# EAGLE design tetris_bigger (EAGLE 6.2)
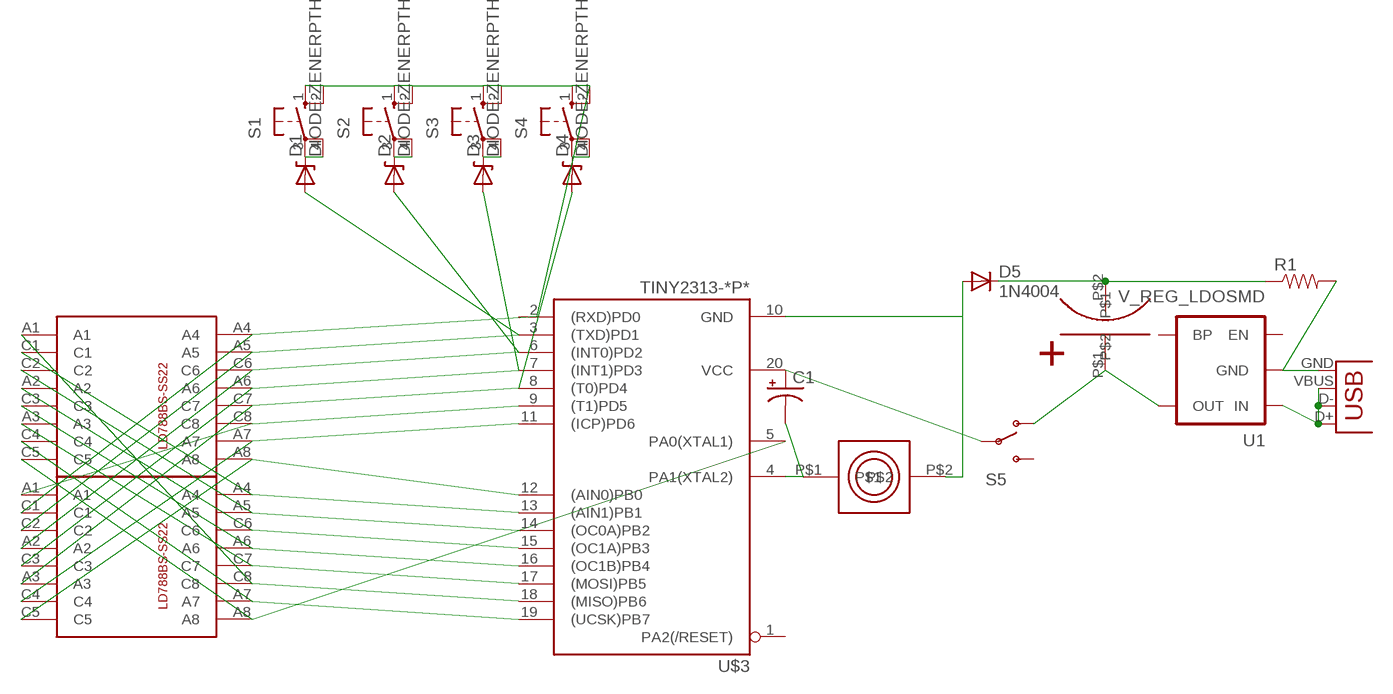
[diagram p0: schematic, sheet 1]

## Parts
C1  CAP_POLPTH1  [CPOL-RADIAL-100UF-25V]
D1  DIODE-ZENERPTH  [DIODE-ZENER]
D2  DIODE-ZENERPTH  [DIODE-ZENER]
D3  DIODE-ZENERPTH  [DIODE-ZENER]
D4  DIODE-ZENERPTH  [DIODE-ZENER]
D5  1N4004  [DO41-10]
R1  RESISTORPTH1  [AXIAL-0.3]
S1  10-XX  [B3F-10XX]
S2  10-XX  [B3F-10XX]
S3  10-XX  [B3F-10XX]
S4  10-XX  [B3F-10XX]
S5  SWITCH-SPSTSMD2  [SWITCH-SPDT-SMD]
U1  V_REG_LDOSMD  [SOT23-5]
U$1  LD-1088BS  [LD-1088BS]
U$2  LD-1088BS  [LD-1088BS]
U$3  TINY2313-*P*  [DIL20]
U$4  I-80450RF  [ISK4.1K_I-80450RF_I2G]
U$5  NICHICON_12F  [NICHICON_10X30]
X1  USB-MICROB  [USB-MICROB]

## Nets
N$1: U$1.A4 U$2.C1 U$3.13((AIN1)PB1)
N$2: U$1.A5 U$2.C2 U$3.14((OC0A)PB2)
N$3: U$1.C6 U$2.A2 U$3.15((OC1A)PB3)
N$4: U$1.A6 U$2.C3 U$3.16((OC1B)PB4)
N$5: U$1.C7 U$2.A3 U$3.17((MOSI)PB5)
N$6: U$1.A7 U$2.C4 U$3.19((UCSK)PB7)
N$7: U$1.A8 U$2.C5 U$3.5(PA0(XTAL1))
N$8: U$1.C8 U$2.A1 U$3.18((MISO)PB6)
N$9: D5.C R1.P$1 U$5.P$2
N$10: D1.P$2(A) U$1.C2 U$2.A5 U$3.3((TXD)PD1)
N$11: D2.P$2(A) U$1.A2 U$2.C6 U$3.6((INT0)PD2)
N$12: D3.P$2(A) U$1.C3 U$2.A6 U$3.7((INT1)PD3)
N$13: D4.P$2(A) U$1.A3 U$2.C7 U$3.8((T0)PD4)
N$14: U$1.A1 U$2.C8 U$3.9((T1)PD5)
N$15: U$1.C4 U$2.A7 U$3.11((ICP)PD6)
N$16: U$1.C5 U$2.A8 U$3.12((AIN0)PB0)
N$17: C1.2(-) U$3.4(PA1(XTAL2)) U$4.P$1
N$18: D5.A U$3.10(GND) U$4.P$2
N$19: S5.1(O) U1.5(OUT) U$5.P$1
N$20: D1.P$1(C) S1.3(P) S1.4(P1)
N$21: D2.P$1(C) S2.3(P) S2.4(P1)
N$22: D3.P$1(C) S3.3(P) S3.4(P1)
N$23: D4.P$1(C) S4.3(P) S4.4(P1)
N$24: R1.P$2 U1.2(GND) X1.GND
N$25: U1.1(IN) X1.D+ X1.D- X1.VBUS
N$26: C1.1(+) S5.2(P) U$3.20(VCC)
N$27: S1.1(S) S1.2(S1) S2.1(S) S2.2(S1) S3.1(S) S3.2(S1) S4.1(S) S4.2(S1) U$1.C1 U$2.A4
Unconnected: S5.3(S) U1.3(EN) U1.4(BP) U$3.1(PA2(/RESET)) U$3.2((RXD)PD0)

## Library data of the parts
C1 = SparkFun:CAP_POL: Capacitor Polarized These are standard SMD and PTH capacitors. Normally 10uF, 47uF, and 100uF in electrolytic and tantalum varieties. Always verify the external diameter of the through hole cap, it varies with capacity, voltage, and manufacturer. The EIA devices should be standard.
D1-D4 = SparkFun:DIODE-ZENER: Zener Diode Production Part - 8199 3.4V Zener Voltage
D5 = adafruit:1N4004: DIODE General purpose 1N400x type rectifier (With bigger pads) http://www.ladyada.net/library/pcb/eaglelibrary.html
R1 = SparkFun:RESISTOR: Resistor Basic schematic elements and footprints for 0603, 1206, and PTH 1/10th watt (small) resistors.
S1-S4 = switch-omron:10-XX: OMRON SWITCH; MPN: B3F-1000; OC_FARNELL: 176432; OC_NEWARK: 36M3542
S5 = SparkFun:SWITCH-SPST: SPST Switch Simple slide switch. Spark Fun Electronics SKU : COM-00102
U1 = SparkFun:V_REG_LDO: Voltage Regulator LDO Standard 150mA LDO voltage regulator in SOT-23 layout. Micrel part MIC5205. BP (by-pass) pin is used to lower output noise with 470pF cap.
U$1 U$2 = mrule:LD-1088BS
U$3 = avr-6:TINY2313*: Atmel Tiny2313 2K Flash, 128 bytes EEPROM, 128 bytes RAM
U$4 = mrule:I-80450RF
U$5 = mrule:NICHICON_12F
X1 = SparkFun:USB: USB Connectors USB-B-PTH is fully proven SKU : PRT-00139 USB-miniB is fully proven SKU : PRT-00587 USB-A-PCB is untested. USB-A-H is throughly reviewed, but untested. Spark Fun Electronics SKU : PRT-00437 USB-B-SMT is throughly reviewed, but untested. Needs silkscreen touching up. USB-A-S has not been used/tested USB-MB-H has not been used/tested

## Board
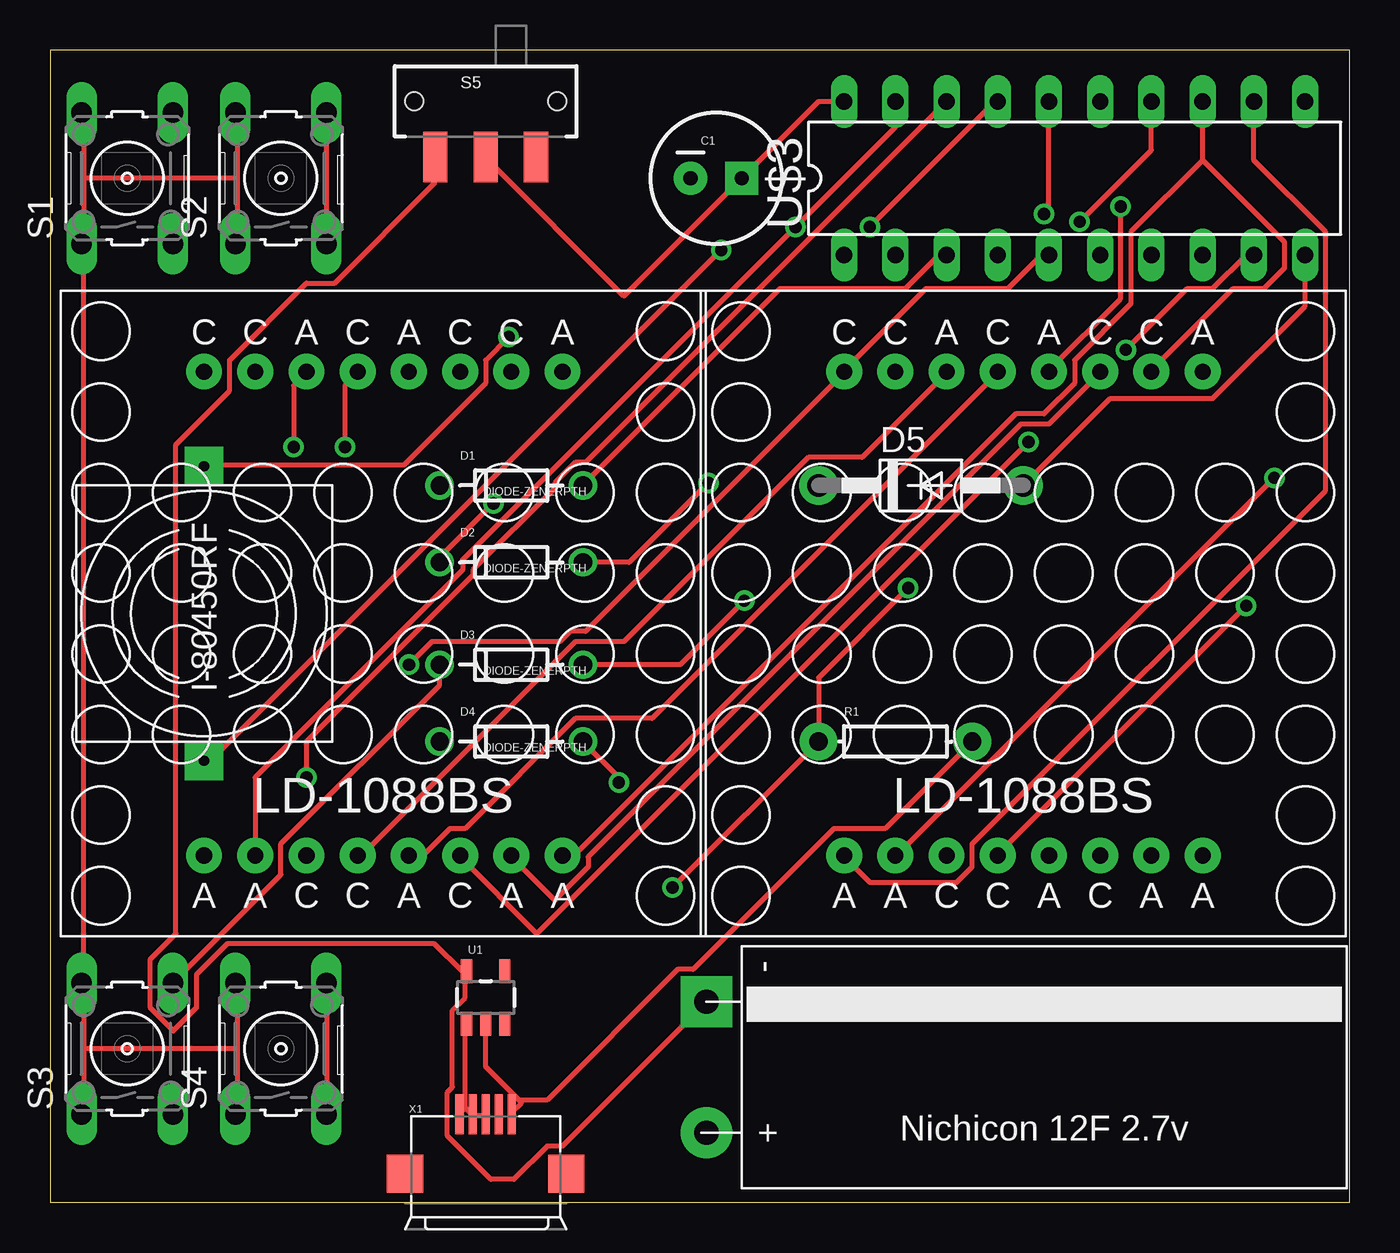
[diagram p1: board, top side]
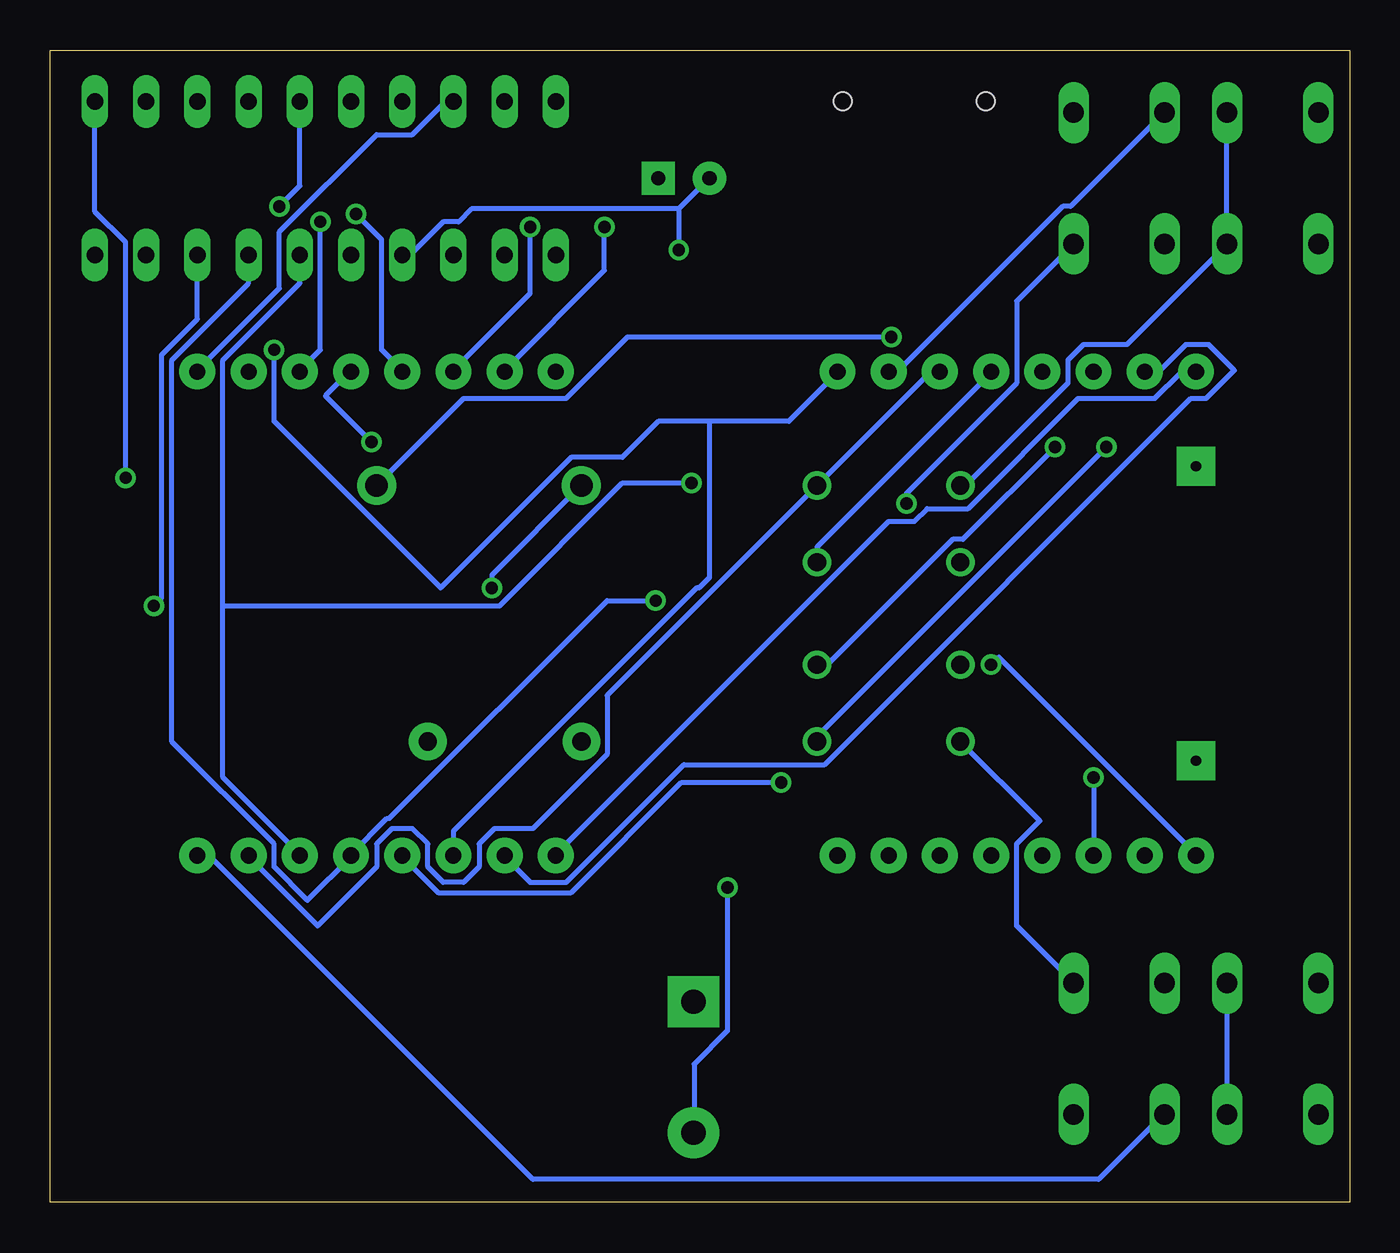
[diagram p2: board, bottom side, seen from below]

Size 64.44 x 57.14 mm. Coordinates in mm from the lower left corner, seen from the top.
Outline: 0,0 64.44,0 64.44,57.14 0,57.14 0,0
Copper layers (1*16): Top 0.035mm / dielectric 1.5mm / Bottom 0.035mm
Design rules: minimum track width 10mil, minimum drill 24mil, track to track 8mil, track to pad 8mil, pad to pad 8mil, via to via 8mil, smd to smd 8mil, copper to edge 40mil, drill to drill 8mil, minimum pad ring 10mil, minimum via ring 8mil, stop-mask expansion 4mil, vias tented up to drill 0mil, thermal gap 10mil

### Footprints (pad centres in the part's own frame; a part is rotated, then mirrored left to right if it is on the bottom)
CPOL-RADIAL-100UF-25V = drill 0.7 pad 1.651 square: 1 1.27,0 | drill 0.7 pad 1.651: 2 -1.27,0
DIODE-ZENER = drill 0.9: P$1 -3.556,0; P$2 3.556,0
DO41-10 = drill 1.118 pad 1.93: A 5.08,0; C -5.08,0
AXIAL-0.3 = drill 0.9 pad 1.88: P$1 -3.81,0; P$2 3.81,0
B3F-10XX = drill 1.016 long: 1 -3.251,2.261; 2 3.251,2.261; 3 -3.251,-2.261; 4 3.251,-2.261
SWITCH-SPDT-SMD = smd 1.2 x 2.5: 1 -2.5,-2.75; 2 0,-2.75; 3 2.5,-2.75 | hole 0.9: -3.55,0; 3.55,0
SOT23-5 = smd 0.55 x 1.2: 1 -0.95,-1.3; 2 0,-1.3; 3 0.95,-1.3; 4 0.95,1.3; 5 -0.95,1.3
LD-1088BS = drill 0.8 pad 1.778: A1 8.89,12; A2 1.27,12; A3 -3.81,12; A4 8.89,-12; A5 6.35,-12; A6 1.27,-12; A7 -6.35,-12; A8 -8.89,-12; C1 6.35,12; C2 3.81,12; C3 -1.27,12; C4 -6.35,12; C5 -8.89,12; C6 3.81,-12; C7 -1.27,-12; C8 -3.81,-12
DIL20 = drill 0.813 long: 1 -11.43,-3.81; 2 -8.89,-3.81; 3 -6.35,-3.81; 4 -3.81,-3.81; 5 -1.27,-3.81; 6 1.27,-3.81; 7 3.81,-3.81; 8 6.35,-3.81; 9 8.89,-3.81; 10 11.43,-3.81; 11 11.43,3.81; 12 8.89,3.81; 13 6.35,3.81; 14 3.81,3.81; 15 1.27,3.81; 16 -1.27,3.81; 17 -3.81,3.81; 18 -6.35,3.81; 19 -8.89,3.81; 20 -11.43,3.81
ISK4.1K_I-80450RF_I2G = drill 0.5 pad 1.93 square: P$1 -7.303,0; P$2 7.303,0
NICHICON_10X30 = drill 1.2 pad 2.54 square: P$1 2.75,-1.75 | drill 1.2 pad 2.54: P$2 9.25,-1.75
USB-MICROB = smd 0.4 x 2: D+ 0,3.1; D- -0.65,3.1; GND 1.3,3.1; ID 0.65,3.1; VBUS -1.3,3.1 | smd 1.8 x 1.9: GND@2 -4,0.15; GND@3 4,0.15

### Placement (x,y rotation side)
C1  33.02,50.8 0 top
D1  22.86,35.56 0 top
D2  22.86,31.75 0 top
D3  22.86,26.67 0 top
D4  22.86,22.86 0 top
D5  43.18,35.56 0 top
R1  41.91,22.86 0 top
S1  3.81,50.8 90 top
S2  11.43,50.8 90 top
S3  3.81,7.62 90 top
S4  11.43,7.62 90 top
S5  21.59,54.61 0 top
U1  21.59,10.16 0 top
U$1  16.51,29.21 0 top
U$2  48.26,29.21 0 top
U$3  50.8,50.8 0 top
U$4  7.62,29.21 90 top
U$5  34.29,12.7 270 top
X1  21.59,1.27 0 top

### Tracks (layer width: path | path; a pad name or v marks a point on that pad's centre or on a via)
N$1
  Top 0.254: 57.15,51.69 U$3.13 | 57.15,51.69 61.21,47.62 61.21,46.35 60.2,45.34 58.67,45.34 54.61,41.27 U$2.C1 | 57.15,51.69 53.59,48.13 53.59,44.58 50.8,41.78 50.8,40.64 49.28,39.12 47.88,39.12 26.04,17.27 25.4,17.27 U$1.A4
N$2  (via drill 0.61)
  Top 0.254: U$3.14 54.61,52.2 v51.05,48.64 | U$1.A5 22.86,17.14 25.02,14.99 26.67,16.64 26.67,17.14 48.13,38.61 49.53,38.61 52.07,41.15 U$2.C2
  Bottom 0.254: v51.05,48.64 51.05,42.29 52.07,41.27 U$2.C2
N$3  (via drill 0.61)
  Top 0.254: v53.09,49.4 53.09,44.83 49.53,41.27 U$2.A2 | v48.51,37.72 24.13,13.34 20.32,17.14 U$1.C6
  Bottom 0.254: U$3.15 52.07,50.42 v53.09,49.4 | v48.51,37.72 50.8,40.01 49.53,41.27 U$2.A2
N$4  (via drill 0.61)
  Top 0.254: U$3.16 49.53,49.28 v49.28,49.02 | U$1.A6 17.78,17.27 18.54,17.27 19.81,18.54 20.57,18.54 26.04,24 29.84,24 46.99,41.15 U$2.C3
  Bottom 0.254: v49.28,49.02 48.01,47.75 48.01,42.29 46.99,41.27 U$2.C3
N$5  (via drill 0.61)
  Top 0.254: U$3.17 46.86,54.61 v40.64,48.39 | U$1.C7 15.24,17.27 15.49,17.27 26.04,27.81 28.45,27.81 37.59,36.96 40.26,36.96 44.45,41.15 U$2.A3
  Bottom 0.254: v40.64,48.39 40.64,45.09 44.45,41.27 U$2.A3
N$6  (via drill 0.61)
  Top 0.254: U$3.19 41.91,53.34 v36.96,48.39 20.45,31.88 20.45,31.37 10.16,21.08 U$1.A7
  Bottom 0.254: v36.96,48.39 36.96,46.23 41.91,41.27 U$2.C4
N$7  (via drill 0.61)
  Top 0.254: U$3.5 49.15,46.99 47.5,45.34 43.43,45.34 39.37,41.27 U$2.C5 39.37,41.15 26.54,28.32 25.78,28.32 25.27,27.81 18.92,27.81 v17.78,26.67
  Bottom 0.254: v17.78,26.67 17.4,27.05 7.62,17.27 U$1.A8
N$8  (via drill 0.61)
  Top 0.254: v12.7,21.08 12.7,22.86 20.95,31.11 20.95,31.37 25.02,35.43 25.02,35.69 26.04,36.7 26.54,36.7 U$3.18
  Bottom 0.254: U$3.18 44.83,54.61 46.48,52.96 48.26,52.96 53.09,48.13 53.09,45.34 57.15,41.27 U$2.A1 | v12.7,21.08 U$1.C8
N$9  (via drill 0.61)
  Top 0.254: v42.55,30.48 38.1,26.04 R1.P$1 v30.86,15.62
  Bottom 0.254: v42.55,30.48 42.55,31.11 D5.C | v30.86,15.62 30.86,8.51 32.51,6.86 32.51,3.56 U$5.P$2
N$10
  Top 0.254: U$3.3 44.07,46.99 42.42,45.34 36.2,45.34 D1.P$2
  Bottom 0.254: U$1.C2 20.32,41.15 20.83,41.15 D1.P$2 36.83,25.15 36.83,22.23 40.51,18.54 42.42,18.54 43.18,17.78 43.18,16.64 43.94,15.88 44.96,15.88 45.72,16.64 45.72,17.78 46.48,18.54 47.5,18.54 48.26,17.78 48.26,16.64 51.18,13.72 54.61,17.14 U$2.A5
N$11  (via drill 0.61)
  Top 0.254: D2.P$2 28.7,31.75 v32.64,35.69
  Bottom 0.254: D2.P$2 26.42,32.51 17.78,41.15 U$1.A2 | U$3.6 52.07,45.59 55.88,41.78 55.88,29.59 | 55.88,29.59 55.88,21.08 52.07,17.27 U$2.C6 | v32.64,35.69 36.07,35.69 42.16,29.59 55.88,29.59
N$12  (via drill 0.61)
  Top 0.254: v14.61,37.47 14.61,40.51 15.24,41.15 U$1.C3 | D3.P$2 31.24,26.67 v34.42,29.84
  Bottom 0.254: D3.P$2 25.91,26.67 19.68,32.89 19.18,32.89 v14.61,37.47 | U$3.7 54.61,45.59 58.42,41.78 58.42,22.86 53.34,17.78 53.34,16.64 51.69,14.99 49.53,17.14 U$2.A6 49.53,17.27 47.75,19.05 47.62,19.05 36.83,29.84 v34.42,29.84
N$13  (via drill 0.61)
  Top 0.254: v12.06,37.47 12.06,40.51 12.7,41.15 U$1.A3 | v59.31,29.59 46.99,17.27 U$2.C7 | D4.P$2 28.32,20.95 v28.19,20.83
  Bottom 0.254: D4.P$2 26.42,23.11 v12.06,37.47 | U$3.8 57.15,43.81 58.93,42.04 58.93,29.97 v59.31,29.59 | v28.19,20.83 33.15,20.83 38.61,15.37 45.21,15.37 46.99,17.14 U$2.C7
N$14  (via drill 0.61)
  Top 0.254: U$3.9 59.31,46.99 57.66,45.34 56.39,45.34 v53.34,42.29
  Bottom 0.254: v53.34,42.29 53.34,38.73 45.09,30.48 38.61,36.96 36.07,36.96 34.29,38.73 31.75,38.73 | 31.75,38.73 27.81,38.73 25.4,41.15 U$1.A1 | U$2.C8 44.45,18.41 32.38,30.48 32.26,30.48 31.75,30.99 31.75,38.73
N$15  (via drill 0.61)
  Top 0.254: v60.71,35.94 41.91,17.14 U$2.A7
  Bottom 0.254: U$3.11 62.23,49.15 60.71,47.62 v60.71,35.94 | U$1.C4 10.16,41.27 9.4,41.27 8.13,42.55 6.99,42.55 5.71,41.27 7.11,39.88 7.87,39.88 26.04,21.72 33.02,21.72 38.86,15.88 40.64,15.88 41.91,17.14 U$2.A7
N$16
  Top 0.254: U$3.12 59.69,51.69 63.25,48.13 63.25,35.31 45.72,17.78 45.72,16.64 44.96,15.88 40.64,15.88 39.37,17.14 U$2.A8
  Bottom 0.254: U$1.C5 7.62,41.15 8.38,41.15 9.65,39.88 13.46,39.88 18.92,34.42 20.95,34.42 21.59,33.78 22.86,33.78 39.37,17.27 U$2.A8
N$17  (via drill 0.61)
  Top 0.254: v33.27,47.24 8,21.97 7.62,21.97 U$4.P$1
  Bottom 0.254: U$3.4 46.61,46.99 44.96,48.64 44.2,48.64 43.56,49.28 33.27,49.28 | C1.2 33.27,49.28 | 33.27,49.28 v33.27,47.24
N$18  (via drill 0.61)
  Top 0.254: U$3.10 62.23,44.45 57.66,39.88 52.58,39.88 D5.A | v22.73,42.93 21.59,41.78 21.59,40.64 17.53,36.58 7.62,36.58 U$4.P$2
  Bottom 0.254: v22.73,42.93 35.81,42.93 38.86,39.88 43.94,39.88 D5.A
N$19
  Top 0.254: U$5.P$1 32.51,9.91 25.4,2.79 24.64,2.79 22.99,1.14 21.84,1.14 19.68,3.3 19.68,5.46 19.94,5.71 19.94,9.53 20.57,10.16 20.57,11.43 U1.5 20.45,11.43 19.05,12.83 8.76,12.83 7.24,11.3 7.24,9.65 6.1,8.51 4.95,9.65 4.95,12.06 6.22,13.34 6.22,37.59 8.89,40.26 8.89,41.78 12.7,45.59 14.1,45.59 19.05,50.55 19.05,51.82 S5.1
N$20
  Bottom 0.254: D1.P$1 19.05,35.56 13.97,40.64 13.97,41.78 13.21,42.55 11.05,42.55 6.1,47.5 S1.3 6.1,47.62 6.1,53.98 S1.4
N$21  (via drill 0.61)
  Top 0.254: D2.P$1 19.3,32 v21.97,34.67 | S2.4 13.72,53.98 13.72,47.62 S2.3
  Bottom 0.254: v21.97,34.67 21.97,35.18 16.51,40.64 16.51,44.7 13.72,47.5 S2.3
N$22
  Top 0.254: D3.P$1 19.3,25.65 11.43,17.78 11.43,16.26 6.1,10.92 S3.4
  Bottom 0.254: S3.3 6.1,4.45 6.1,10.79 S3.4
N$23
  Top 0.254: S4.3 13.72,4.45 13.72,10.79 S4.4
  Bottom 0.254: D4.P$1 15.37,18.92 16.51,17.78 16.51,13.72 13.72,10.92 S4.4
N$24
  Top 0.254: U1.2 21.59,6.73 23.3,5.02 | 23.3,5.02 23.37,4.95 22.86,4.45 X1.GND | R1.P$2 41.4,18.54 38.86,18.54 31.88,11.56 31.11,11.56 24.64,5.08 23.37,5.08 23.3,5.02
N$25
  Top 0.254: 20.57,4.7 20.57,8.76 U1.1 | 20.57,4.7 20.32,4.45 X1.VBUS | 20.57,4.7 20.83,4.45 X1.D- 20.95,4.32 21.59,4.32 X1.D+
N$26
  Top 0.254: S5.2 21.59,51.82 28.45,44.96 C1.1 38.1,54.61 U$3.20
N$27
  Top 0.254: 1.65,50.8 1.65,53.98 S1.2 | 1.65,50.8 1.65,47.62 S1.1 1.65,47.5 1.65,10.92 S3.2 1.65,10.79 1.65,7.62 | 9.27,50.8 9.27,53.98 S2.2 | 9.27,50.8 9.27,47.62 S2.1 | 9.27,50.8 1.65,50.8 | 1.65,7.62 1.65,4.45 S3.1 | 9.27,7.62 9.27,10.79 S4.2 | 9.27,7.62 9.27,4.45 S4.1 | 9.27,7.62 1.65,7.62
  Bottom 0.254: U$1.C1 22.86,41.27 22.35,41.27 14.22,49.4 13.84,49.4 9.27,53.98 S2.2 | U$2.A4 57.15,17.14 56.52,17.14 40.51,1.14 12.45,1.14 9.27,4.32 S4.1